# EAGLE design BUS_SPLIT_DISPLAY_1 (EAGLE 6.5.0)

## Sheet 1 of 3
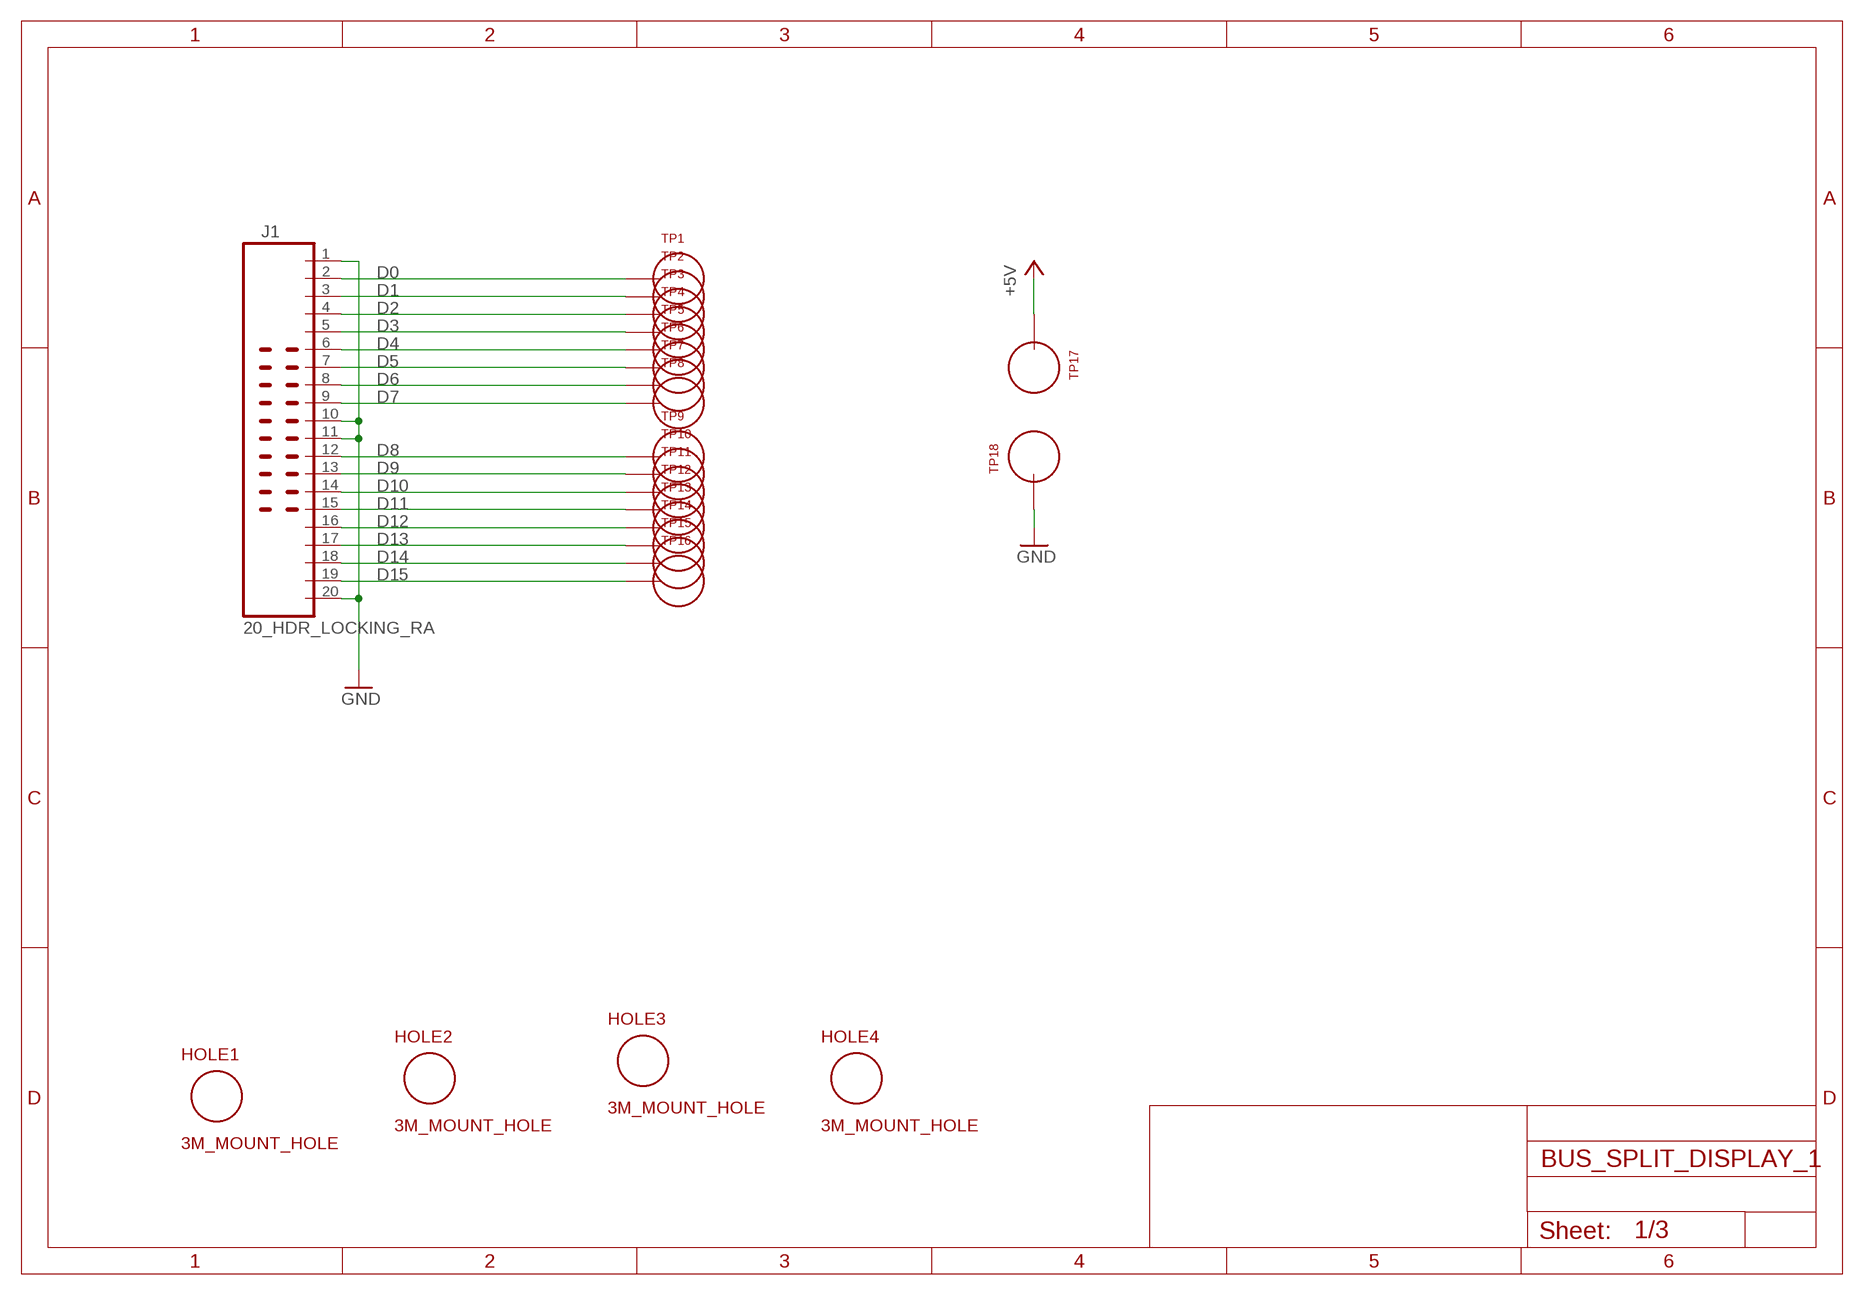
[diagram p0: schematic, sheet 1]

### Parts
HOLE1  3M_MOUNT_HOLE  [3M_HOLE]
HOLE2  3M_MOUNT_HOLE  [3M_HOLE]
HOLE3  3M_MOUNT_HOLE  [3M_HOLE]
HOLE4  3M_MOUNT_HOLE  [3M_HOLE]
J1  20_HDR_LOCKING_RA  [20_HDR_LOCKING_RA]
TP1  TEST_LOOP  [TEST_LOOP]
TP2  TEST_LOOP  [TEST_LOOP]
TP3  TEST_LOOP  [TEST_LOOP]
TP4  TEST_LOOP  [TEST_LOOP]
TP5  TEST_LOOP  [TEST_LOOP]
TP6  TEST_LOOP  [TEST_LOOP]
TP7  TEST_LOOP  [TEST_LOOP]
TP8  TEST_LOOP  [TEST_LOOP]
TP9  TEST_LOOP  [TEST_LOOP]
TP10  TEST_LOOP  [TEST_LOOP]
TP11  TEST_LOOP  [TEST_LOOP]
TP12  TEST_LOOP  [TEST_LOOP]
TP13  TEST_LOOP  [TEST_LOOP]
TP14  TEST_LOOP  [TEST_LOOP]
TP15  TEST_LOOP  [TEST_LOOP]
TP16  TEST_LOOP  [TEST_LOOP]
TP17  TEST_LOOP  [TEST_LOOP]
TP18  TEST_LOOP  [TEST_LOOP]

### Nets
+5V: TP17.P$1 ; also sheet 2,3
D0: J1.2 TP1.P$1 ; also sheet 2
D1: J1.3 TP2.P$1 ; also sheet 2
D2: J1.4 TP3.P$1 ; also sheet 2
D3: J1.5 TP4.P$1 ; also sheet 2
D4: J1.6 TP5.P$1 ; also sheet 2
D5: J1.7 TP6.P$1 ; also sheet 2
D6: J1.8 TP7.P$1 ; also sheet 2
D7: J1.9 TP8.P$1 ; also sheet 2
D8: J1.12 TP9.P$1 ; also sheet 3
D9: J1.13 TP10.P$1 ; also sheet 3
D10: J1.14 TP11.P$1 ; also sheet 3
D11: J1.15 TP12.P$1 ; also sheet 3
D12: J1.16 TP13.P$1 ; also sheet 3
D13: J1.17 TP14.P$1 ; also sheet 3
D14: J1.18 TP15.P$1 ; also sheet 3
D15: J1.19 TP16.P$1 ; also sheet 3
GND: J1.1 J1.10 J1.11 J1.20 TP18.P$1 ; also sheet 2,3

## Sheet 2 of 3
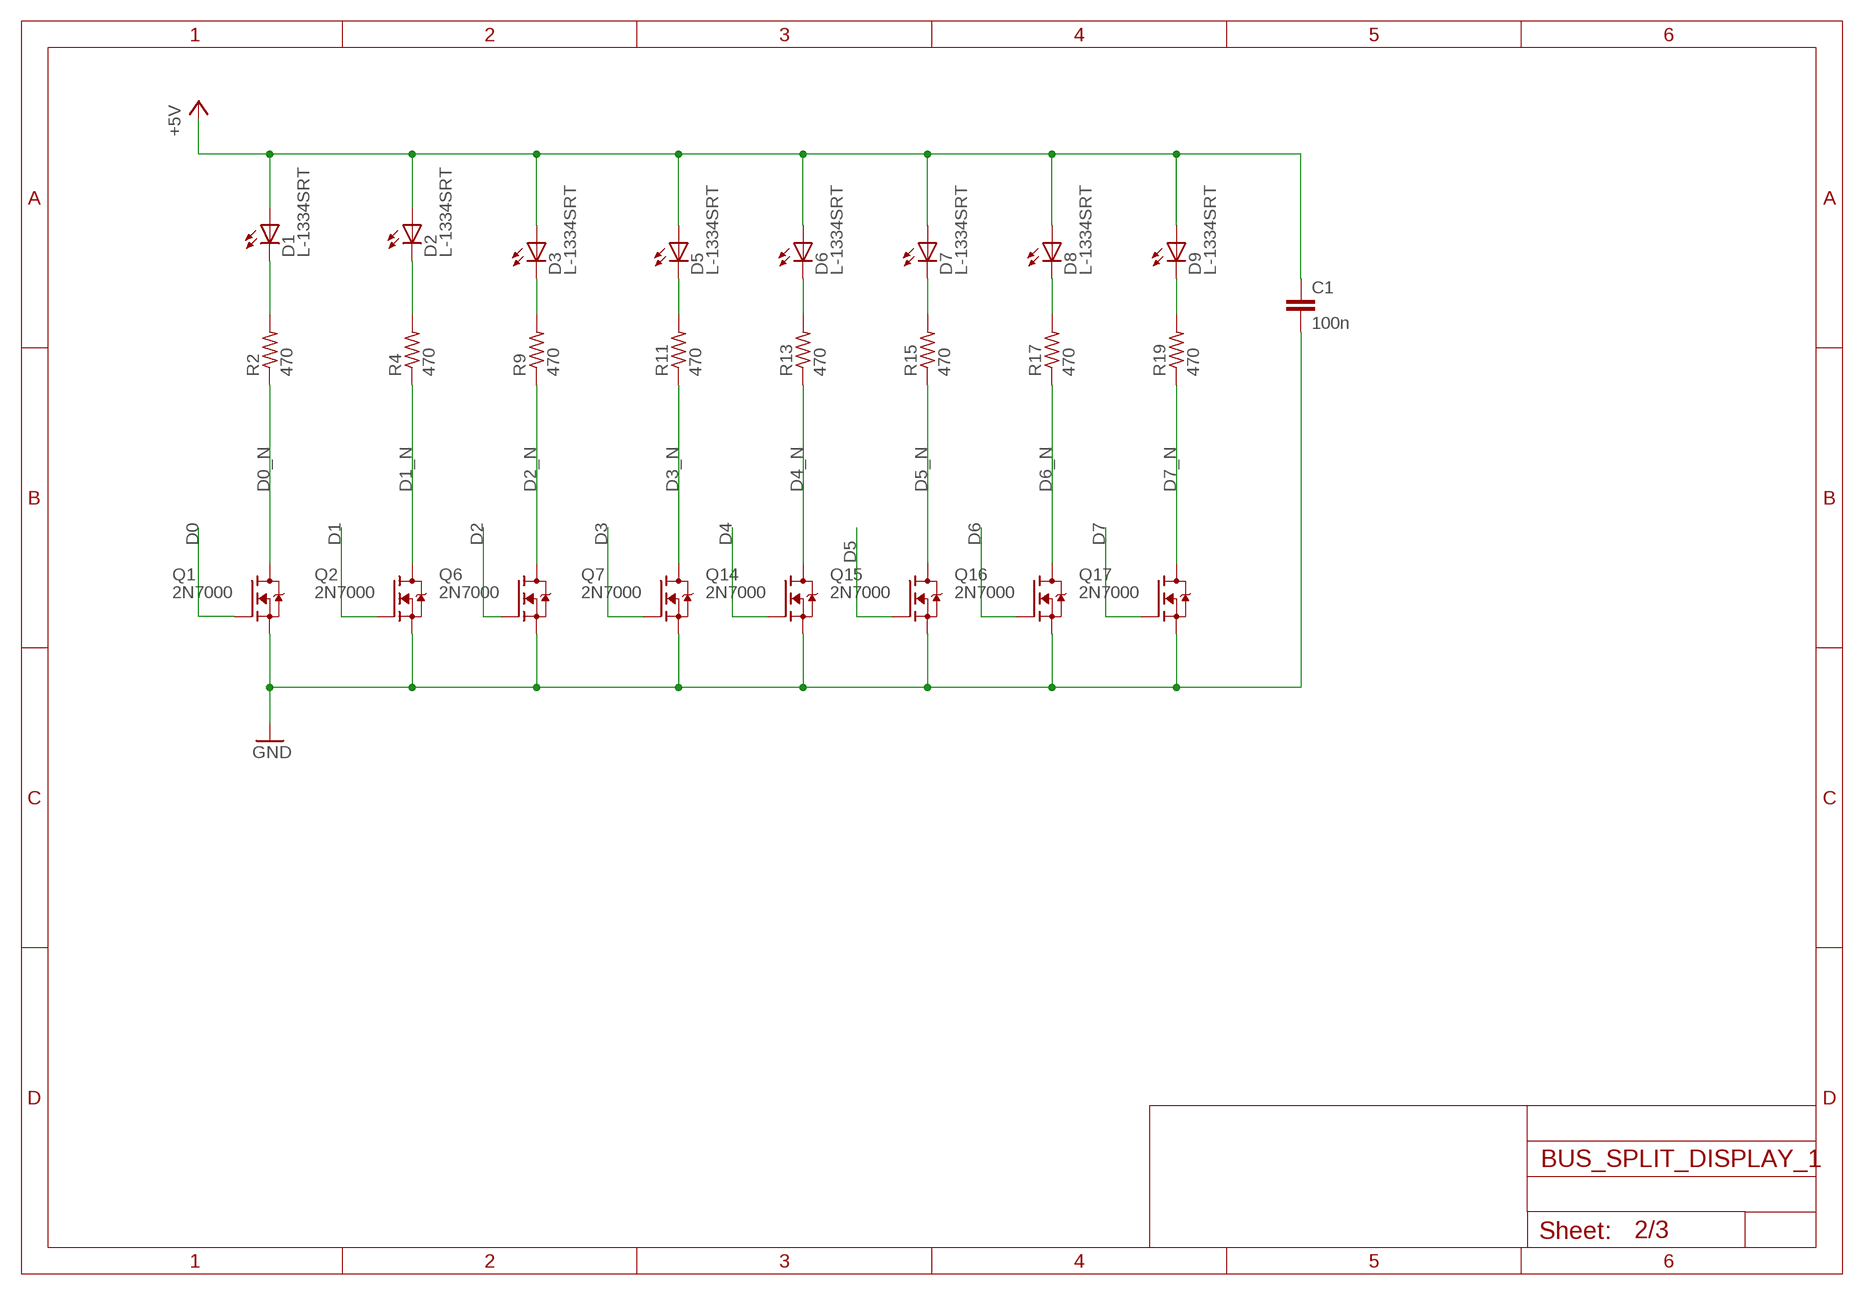
[diagram p1: schematic, sheet 2]

### Parts
C1  100n  C_P2INCH  [CAP_P2INCH]
D1  L-1334SRT  [LED3MM]
D2  L-1334SRT  [LED3MM]
D3  L-1334SRT  [LED3MM]
D5  L-1334SRT  [LED3MM]
D6  L-1334SRT  [LED3MM]
D7  L-1334SRT  [LED3MM]
D8  L-1334SRT  [LED3MM]
D9  L-1334SRT  [LED3MM]
Q1  2N7000  [TO92-DGS]
Q2  2N7000  [TO92-DGS]
Q6  2N7000  [TO92-DGS]
Q7  2N7000  [TO92-DGS]
Q14  2N7000  [TO92-DGS]
Q15  2N7000  [TO92-DGS]
Q16  2N7000  [TO92-DGS]
Q17  2N7000  [TO92-DGS]
R2  470  R_P2INCH  [R_P2INCH]
R4  470  R_P2INCH  [R_P2INCH]
R9  470  R_P2INCH  [R_P2INCH]
R11  470  R_P2INCH  [R_P2INCH]
R13  470  R_P2INCH  [R_P2INCH]
R15  470  R_P2INCH  [R_P2INCH]
R17  470  R_P2INCH  [R_P2INCH]
R19  470  R_P2INCH  [R_P2INCH]

### Nets
+5V: C1.1 D1.A D2.A D3.A D5.A D6.A D7.A D8.A D9.A ; also sheet 1,3
D0: Q1.G ; also sheet 1
D0_N: Q1.D R2.1
D1: Q2.G ; also sheet 1
D1_N: Q2.D R4.1
D2: Q6.G ; also sheet 1
D2_N: Q6.D R9.1
D3: Q7.G ; also sheet 1
D3_N: Q7.D R11.1
D4: Q14.G ; also sheet 1
D4_N: Q14.D R13.1
D5: Q15.G ; also sheet 1
D5_N: Q15.D R15.1
D6: Q16.G ; also sheet 1
D6_N: Q16.D R17.1
D7: Q17.G ; also sheet 1
D7_N: Q17.D R19.1
GND: C1.2 Q1.S Q2.S Q6.S Q7.S Q14.S Q15.S Q16.S Q17.S ; also sheet 1,3
N$23: D2.K(C) R4.2
N$24: D1.K(C) R2.2
N$28: D5.K(C) R11.2
N$29: D3.K(C) R9.2
N$35: D6.K(C) R13.2
N$36: D7.K(C) R15.2
N$37: D8.K(C) R17.2
N$38: D9.K(C) R19.2

## Sheet 3 of 3
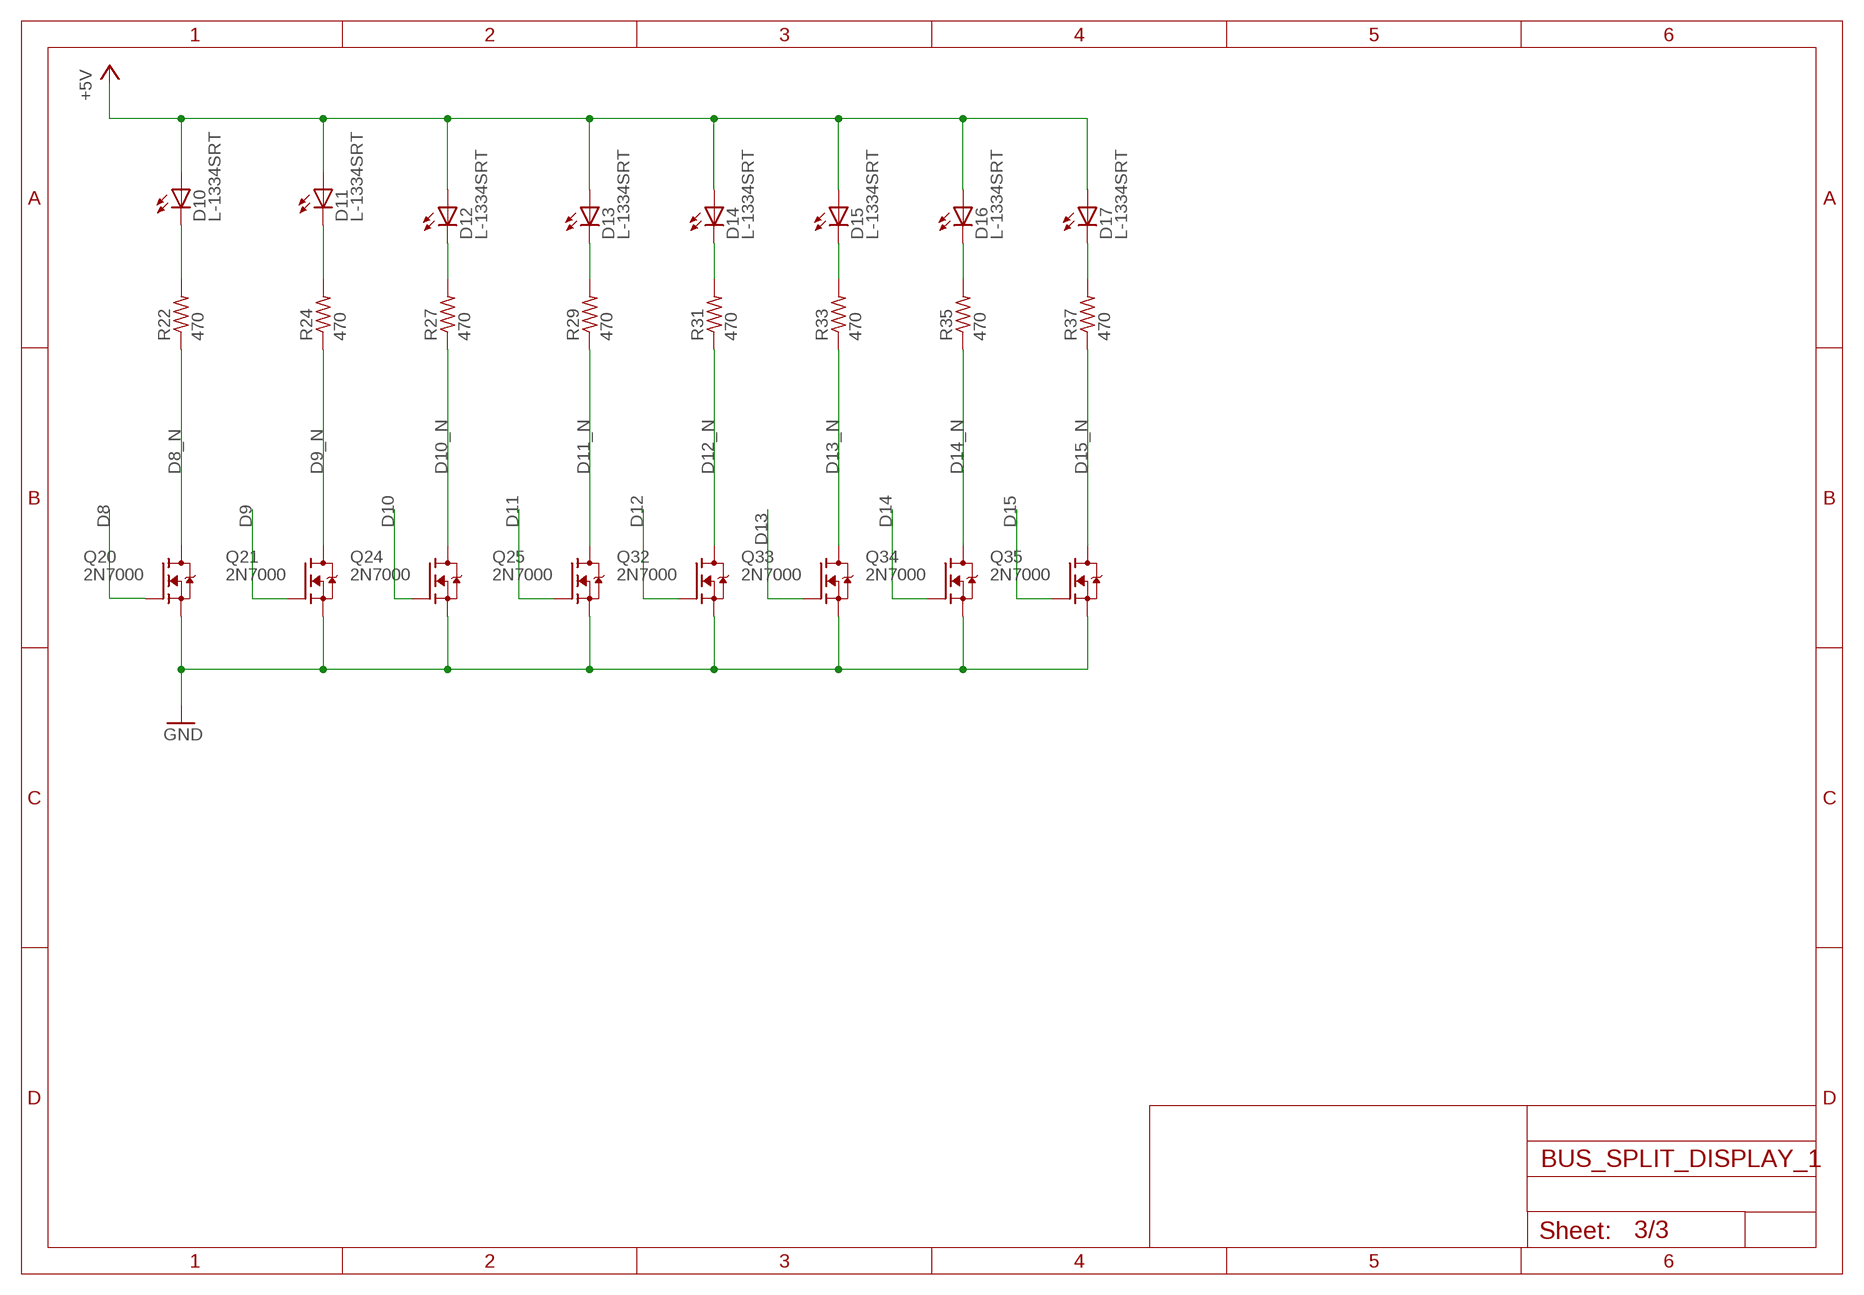
[diagram p2: schematic, sheet 3]

### Parts
D10  L-1334SRT  [LED3MM]
D11  L-1334SRT  [LED3MM]
D12  L-1334SRT  [LED3MM]
D13  L-1334SRT  [LED3MM]
D14  L-1334SRT  [LED3MM]
D15  L-1334SRT  [LED3MM]
D16  L-1334SRT  [LED3MM]
D17  L-1334SRT  [LED3MM]
Q20  2N7000  [TO92-DGS]
Q21  2N7000  [TO92-DGS]
Q24  2N7000  [TO92-DGS]
Q25  2N7000  [TO92-DGS]
Q32  2N7000  [TO92-DGS]
Q33  2N7000  [TO92-DGS]
Q34  2N7000  [TO92-DGS]
Q35  2N7000  [TO92-DGS]
R22  470  R_P2INCH  [R_P2INCH]
R24  470  R_P2INCH  [R_P2INCH]
R27  470  R_P2INCH  [R_P2INCH]
R29  470  R_P2INCH  [R_P2INCH]
R31  470  R_P2INCH  [R_P2INCH]
R33  470  R_P2INCH  [R_P2INCH]
R35  470  R_P2INCH  [R_P2INCH]
R37  470  R_P2INCH  [R_P2INCH]

### Nets
+5V: D10.A D11.A D12.A D13.A D14.A D15.A D16.A D17.A ; also sheet 1,2
D8: Q20.G ; also sheet 1
D8_N: Q20.D R22.1
D9: Q21.G ; also sheet 1
D9_N: Q21.D R24.1
D10: Q24.G ; also sheet 1
D10_N: Q24.D R27.1
D11: Q25.G ; also sheet 1
D11_N: Q25.D R29.1
D12: Q32.G ; also sheet 1
D12_N: Q32.D R31.1
D13: Q33.G ; also sheet 1
D13_N: Q33.D R33.1
D14: Q34.G ; also sheet 1
D14_N: Q34.D R35.1
D15: Q35.G ; also sheet 1
D15_N: Q35.D R37.1
GND: Q20.S Q21.S Q24.S Q25.S Q32.S Q33.S Q34.S Q35.S ; also sheet 1,2
N$1: D11.K(C) R24.2
N$3: D10.K(C) R22.2
N$6: D13.K(C) R29.2
N$7: D12.K(C) R27.2
N$13: D14.K(C) R31.2
N$14: D15.K(C) R33.2
N$15: D16.K(C) R35.2
N$16: D17.K(C) R37.2

## Library data of the parts
C1 = MyLib:C_P2INCH
D1-D3 D5-D17 = MyLib:L-1334SRT
HOLE1-HOLE4 = MyLib:3M_MOUNT_HOLE
J1 = MyLib:20_HDR_LOCKING_RA
Q1 Q2 Q6 Q7 Q14-Q17 Q20 Q21 Q24 Q25 Q32-Q35 = MyLib:2N7000
R2 R4 R9 R11 R13 R15 R17 R19 R22 R24 R27 R29 R31 R33 R35 R37 = MyLib:R_P2INCH
TP1-TP18 = MyLib:TEST_LOOP

## Board
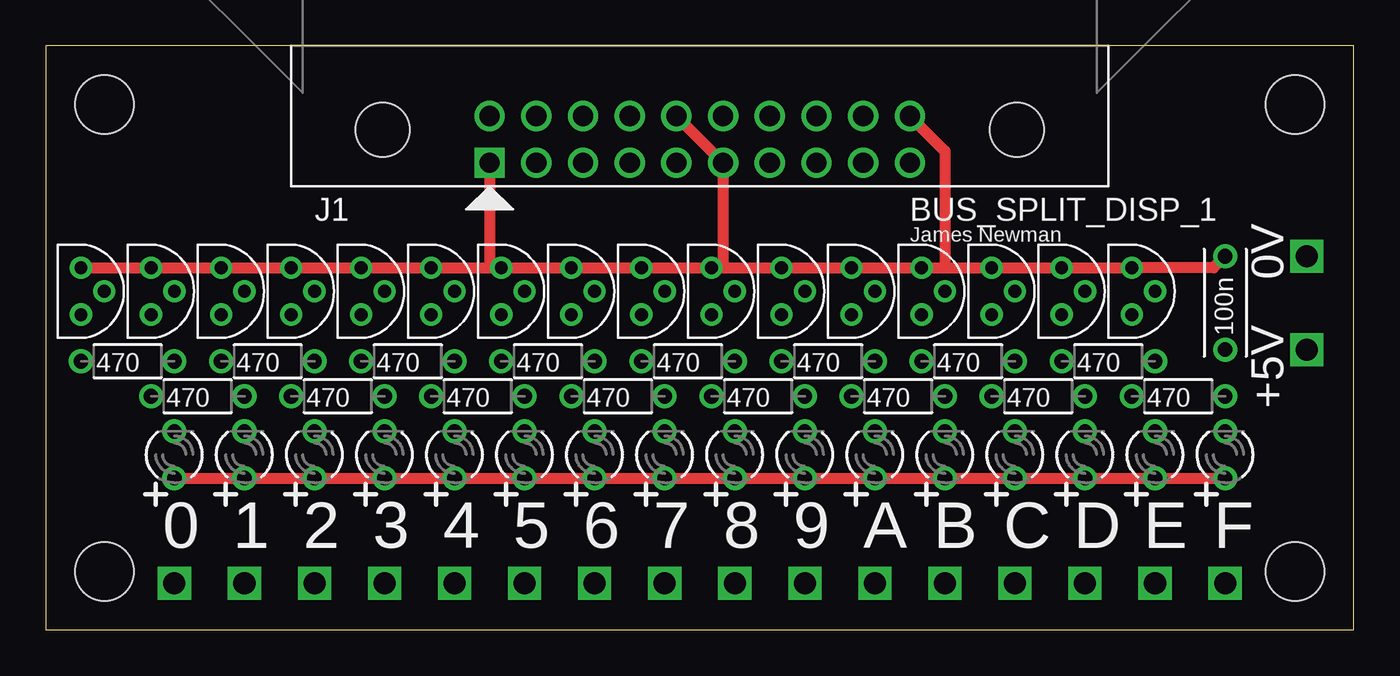
[diagram p3: board, top side]
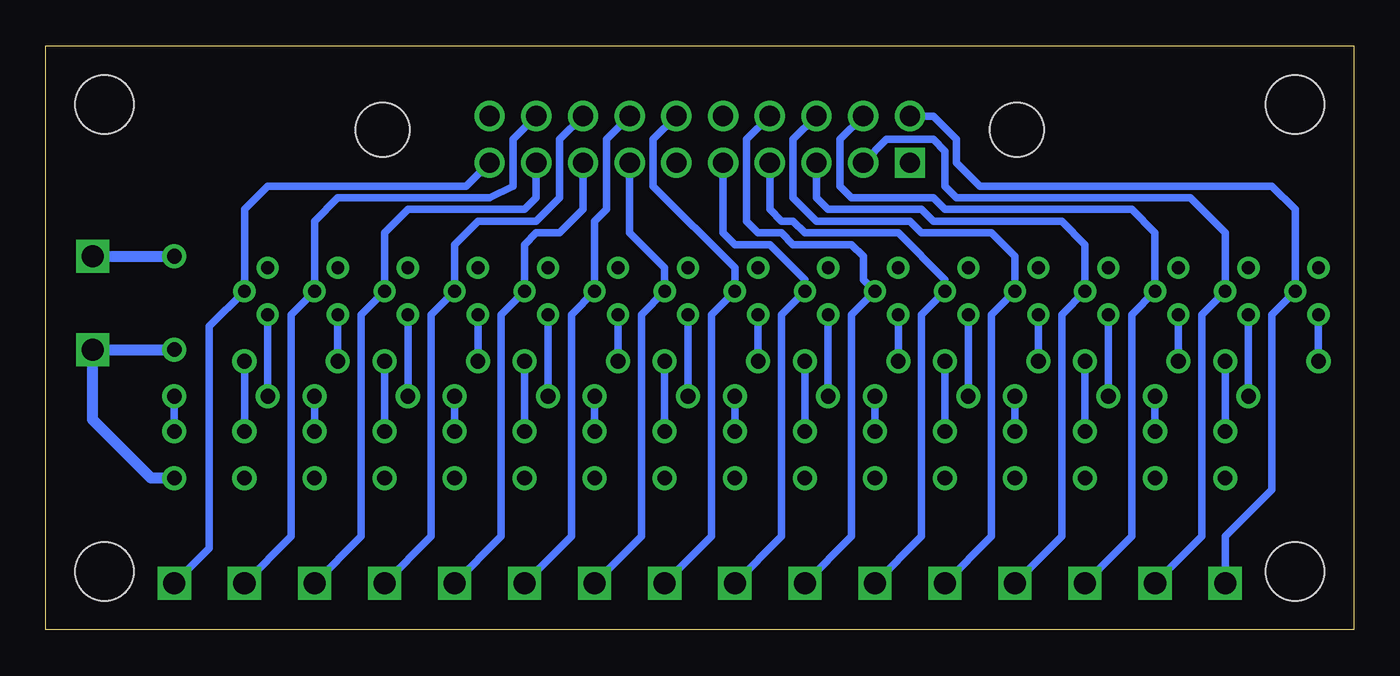
[diagram p4: board, bottom side, seen from below]

Size 71.12 x 31.75 mm. Coordinates in mm from the lower left corner, seen from the top.
Outline: 0,0 71.12,0 71.12,31.75 0,31.75 0,0
Copper layers (1*16): Top 0.035mm / dielectric 1.5mm / Bottom 0.035mm
Design rules "processor_rules_2layer": minimum track width 8mil, minimum drill 14mil, track to track 8mil, track to pad 8mil, pad to pad 8mil, via to via 8mil, smd to smd 8mil, copper to edge 40mil, drill to drill 8mil, minimum pad ring 10mil, minimum via ring 8mil, stop-mask expansion 4mil, vias tented up to drill 0.7mm, thermal gap 10mil

### Footprints (pad centres in the part's own frame; a part is rotated, then mirrored left to right if it is on the bottom)
CAP_P2INCH = drill 0.8: 1 -2.54,0; 2 2.54,0
LED3MM = drill 0.8: A -1.27,0; K 1.27,0
3M_HOLE = hole 3.2: 0,0
20_HDR_LOCKING_RA = drill 1.1 square: 1 -11.43,-1.27 | drill 1.1: 2 -11.43,1.27; 3 -8.89,-1.27; 4 -8.89,1.27; 5 -6.35,-1.27; 6 -6.35,1.27; 7 -3.81,-1.27; 8 -3.81,1.27; 9 -1.27,-1.27; 10 -1.27,1.27; 11 1.27,-1.27; 12 1.27,1.27; 13 3.81,-1.27; 14 3.81,1.27; 15 6.35,-1.27; 16 6.35,1.27; 17 8.89,-1.27; 18 8.89,1.27; 19 11.43,-1.27; 20 11.43,1.27 | hole 2.946: -17.247,0.533; 17.247,0.533
TO92-DGS = drill 0.7: D 0,1.27; G -1.27,0; S 0,-1.27
R_P2INCH = drill 0.8: 1 -2.54,0; 2 2.54,0
TEST_LOOP = drill 1.2 square: P$1 0,0

### Placement (x,y rotation side)
C1  64.14,17.78 90 top
D1  6.99,9.53 90 top
D2  10.79,9.53 90 top
D3  14.61,9.53 90 top
D5  18.41,9.53 90 top
D6  22.23,9.53 90 top
D7  26.04,9.53 90 top
D8  29.84,9.53 90 top
D9  33.66,9.53 90 top
D10  37.47,9.53 90 top
D11  41.27,9.53 90 top
D12  45.09,9.53 90 top
D13  48.9,9.53 90 top
D14  52.7,9.53 90 top
D15  56.52,9.53 90 top
D16  60.33,9.53 90 top
D17  64.14,9.53 90 top
HOLE1  67.94,3.17 0 top
HOLE2  67.94,28.57 0 top
HOLE3  3.17,3.17 0 top
HOLE4  3.17,28.57 0 top
J1  35.56,26.67 0 top
Q1  1.91,18.41 180 top
Q2  5.71,18.41 180 top
Q6  9.53,18.41 180 top
Q7  13.34,18.41 180 top
Q14  17.14,18.41 180 top
Q15  20.95,18.41 180 top
Q16  24.77,18.41 180 top
Q17  28.57,18.41 180 top
Q20  32.38,18.41 180 top
Q21  36.2,18.41 180 top
Q24  40.01,18.41 180 top
Q25  43.81,18.41 180 top
Q32  47.62,18.41 180 top
Q33  51.44,18.41 180 top
Q34  55.24,18.41 180 top
Q35  59.05,18.41 180 top
R2  4.45,14.61 0 top
R4  8.26,12.7 0 top
R9  12.06,14.61 0 top
R11  15.88,12.7 0 top
R13  19.68,14.61 0 top
R15  23.5,12.7 0 top
R17  27.3,14.61 0 top
R19  31.11,12.7 0 top
R22  34.92,14.61 0 top
R24  38.73,12.7 0 top
R27  42.55,14.61 0 top
R29  46.35,12.7 0 top
R31  50.16,14.61 0 top
R33  53.98,12.7 0 top
R35  57.78,14.61 0 top
R37  61.59,12.7 0 top
TP1  6.99,2.54 90 top
TP2  10.79,2.54 90 top
TP3  14.61,2.54 90 top
TP4  18.41,2.54 90 top
TP5  22.23,2.54 90 top
TP6  26.04,2.54 90 top
TP7  29.84,2.54 90 top
TP8  33.66,2.54 90 top
TP9  37.47,2.54 90 top
TP10  41.27,2.54 90 top
TP11  45.09,2.54 90 top
TP12  48.9,2.54 90 top
TP13  52.7,2.54 90 top
TP14  56.52,2.54 90 top
TP15  60.33,2.54 90 top
TP16  64.14,2.54 90 top
TP17  68.58,15.24 0 top
TP18  68.58,20.32 0 top

### Tracks (layer width: path | path; a pad name or v marks a point on that pad's centre or on a via)
+5V
  Top 0.61: D1.A D2.A D3.A D5.A D6.A D7.A D8.A D9.A D10.A D11.A D12.A D13.A D14.A D15.A D16.A D17.A
  Bottom 0.61: C1.1 TP17.P$1 68.58,11.43 65.41,8.26 D17.A
D0
  Bottom 0.406: J1.2 22.86,27.94 21.59,26.67 21.59,25.4 20.32,24.13 4.45,24.13 3.17,22.86 Q1.G 4.45,17.14 4.45,7.62 6.99,5.08 TP1.P$1
D0_N
  Bottom 0.406: Q1.D R2.1
D1
  Bottom 0.406: TP2.P$1 8.26,5.08 8.26,17.14 Q2.G 6.99,21.59 8.89,23.5 21.59,23.5 22.23,24.13 22.23,26.04 22.86,26.67 25.4,26.67 J1.3
D1_N
  Bottom 0.406: Q2.D R4.1
D2
  Bottom 0.406: J1.4 27.94,26.67 27.94,24.13 27.3,23.5 22.86,23.5 22.23,22.86 12.06,22.86 10.79,21.59 Q6.G 12.06,17.14 12.06,5.08 TP3.P$1
D2_N
  Bottom 0.406: Q6.D R9.1
D3
  Bottom 0.406: J1.5 29.21,23.5 28.57,22.86 23.5,22.86 22.86,22.23 15.88,22.23 14.61,20.95 Q7.G 15.88,17.14 15.88,5.08 TP4.P$1
D3_N
  Bottom 0.406: Q7.D R11.1
D4
  Bottom 0.406: J1.6 30.48,26.67 30.48,23.5 29.21,22.23 24.13,22.23 23.5,21.59 19.68,21.59 18.41,20.32 Q14.G 19.68,17.14 19.68,5.08 TP5.P$1
D4_N
  Bottom 0.406: Q14.D R13.1
D5
  Bottom 0.406: J1.7 31.75,22.86 31.11,22.23 30.48,22.23 29.84,21.59 24.77,21.59 22.23,19.05 Q15.G 23.5,17.14 23.5,5.08 TP6.P$1
D5_N
  Bottom 0.406: Q15.D R15.1
D6
  Bottom 0.406: J1.8 33.02,26.67 33.02,22.23 32.38,21.59 31.11,21.59 30.48,20.95 27.3,20.95 26.67,20.32 26.67,19.05 Q16.G 27.3,17.14 27.3,5.08 TP7.P$1
D6_N
  Bottom 0.406: Q16.D R17.1
D7
  Bottom 0.406: J1.9 34.29,21.59 33.66,20.95 31.75,20.95 29.84,19.05 Q17.G 31.11,17.14 31.11,5.08 TP8.P$1
D7_N
  Bottom 0.406: Q17.D R19.1
D8
  Bottom 0.406: J1.12 38.1,26.67 38.1,24.13 33.66,19.68 Q20.G 34.92,17.14 34.92,5.08 TP9.P$1
D8_N
  Bottom 0.406: Q20.D R22.1
D9
  Bottom 0.406: J1.13 39.37,21.59 37.47,19.68 Q21.G 38.73,17.14 38.73,5.08 TP10.P$1
D9_N
  Bottom 0.406: Q21.D R24.1
D10
  Bottom 0.406: J1.14 40.64,26.67 40.64,22.86 41.27,22.23 Q24.G 42.55,17.14 42.55,5.08 TP11.P$1
D10_N
  Bottom 0.406: Q24.D R27.1
D11
  Bottom 0.406: J1.15 41.91,22.86 43.18,21.59 44.45,21.59 45.09,20.95 Q25.G 46.35,17.14 46.35,5.08 TP12.P$1
D11_N
  Bottom 0.406: Q25.D R29.1
D12
  Bottom 0.406: J1.16 43.18,26.67 43.18,23.5 44.45,22.23 47.62,22.23 48.9,20.95 Q32.G 50.16,17.14 50.16,5.08 TP13.P$1
D12_N
  Bottom 0.406: Q32.D R31.1
D13
  Bottom 0.406: J1.17 44.45,23.5 45.09,22.86 51.44,22.86 52.7,21.59 Q33.G 53.98,17.14 53.98,5.08 TP14.P$1
D13_N
  Bottom 0.406: Q33.D R33.1
D14
  Bottom 0.406: J1.18 45.72,26.67 45.72,24.13 46.99,23.5 55.24,23.5 56.52,22.23 Q34.G 57.78,17.14 57.78,5.08 TP15.P$1
D14_N
  Bottom 0.406: Q34.D R35.1
D15
  Bottom 0.406: J1.19 48.26,24.13 59.05,24.13 60.33,22.86 Q35.G 62.23,16.51 62.23,4.45 TP16.P$1
D15_N
  Bottom 0.406: Q35.D R37.1
GND
  Top 0.61: Q1.S Q2.S Q6.S Q7.S Q14.S Q15.S 24.13,19.68 | 24.13,19.68 Q16.S Q17.S Q20.S Q21.S 36.83,19.68 | 36.83,19.68 Q24.S Q25.S Q32.S 48.9,19.68 | 48.9,19.68 Q33.S Q34.S Q35.S 63.5,19.68 C1.2 | J1.10 J1.11 36.83,19.68 | J1.1 24.13,19.68 | J1.20 48.9,26.04 48.9,19.68
  Bottom 0.61: TP18.P$1 C1.2
N$1
  Bottom 0.406: R24.2 D11.K
N$3
  Bottom 0.406: R22.2 D10.K
N$6
  Bottom 0.406: R29.2 D13.K
N$7
  Bottom 0.406: R27.2 D12.K
N$13
  Bottom 0.406: R31.2 D14.K
N$14
  Bottom 0.406: R33.2 D15.K
N$15
  Bottom 0.406: R35.2 D16.K
N$16
  Bottom 0.406: R37.2 D17.K
N$23
  Bottom 0.406: R4.2 D2.K
N$24
  Bottom 0.406: R2.2 D1.K
N$28
  Bottom 0.406: R11.2 D5.K
N$29
  Bottom 0.406: R9.2 D3.K
N$35
  Bottom 0.406: R13.2 D6.K
N$36
  Bottom 0.406: R15.2 D7.K
N$37
  Bottom 0.406: R17.2 D8.K
N$38
  Bottom 0.406: R19.2 D9.K

### Text on the board
tPlace: BUS_SPLIT_DISP_1 | James Newman | 0V | +5V | 0 | 1 | 2 | 3 | 4 | 5 | 6 | 7 | 8 | 9 | A | B | C | D | E | F